# EAGLE board aqc-rev3 (EAGLE 9.2.2), part 1 of 2
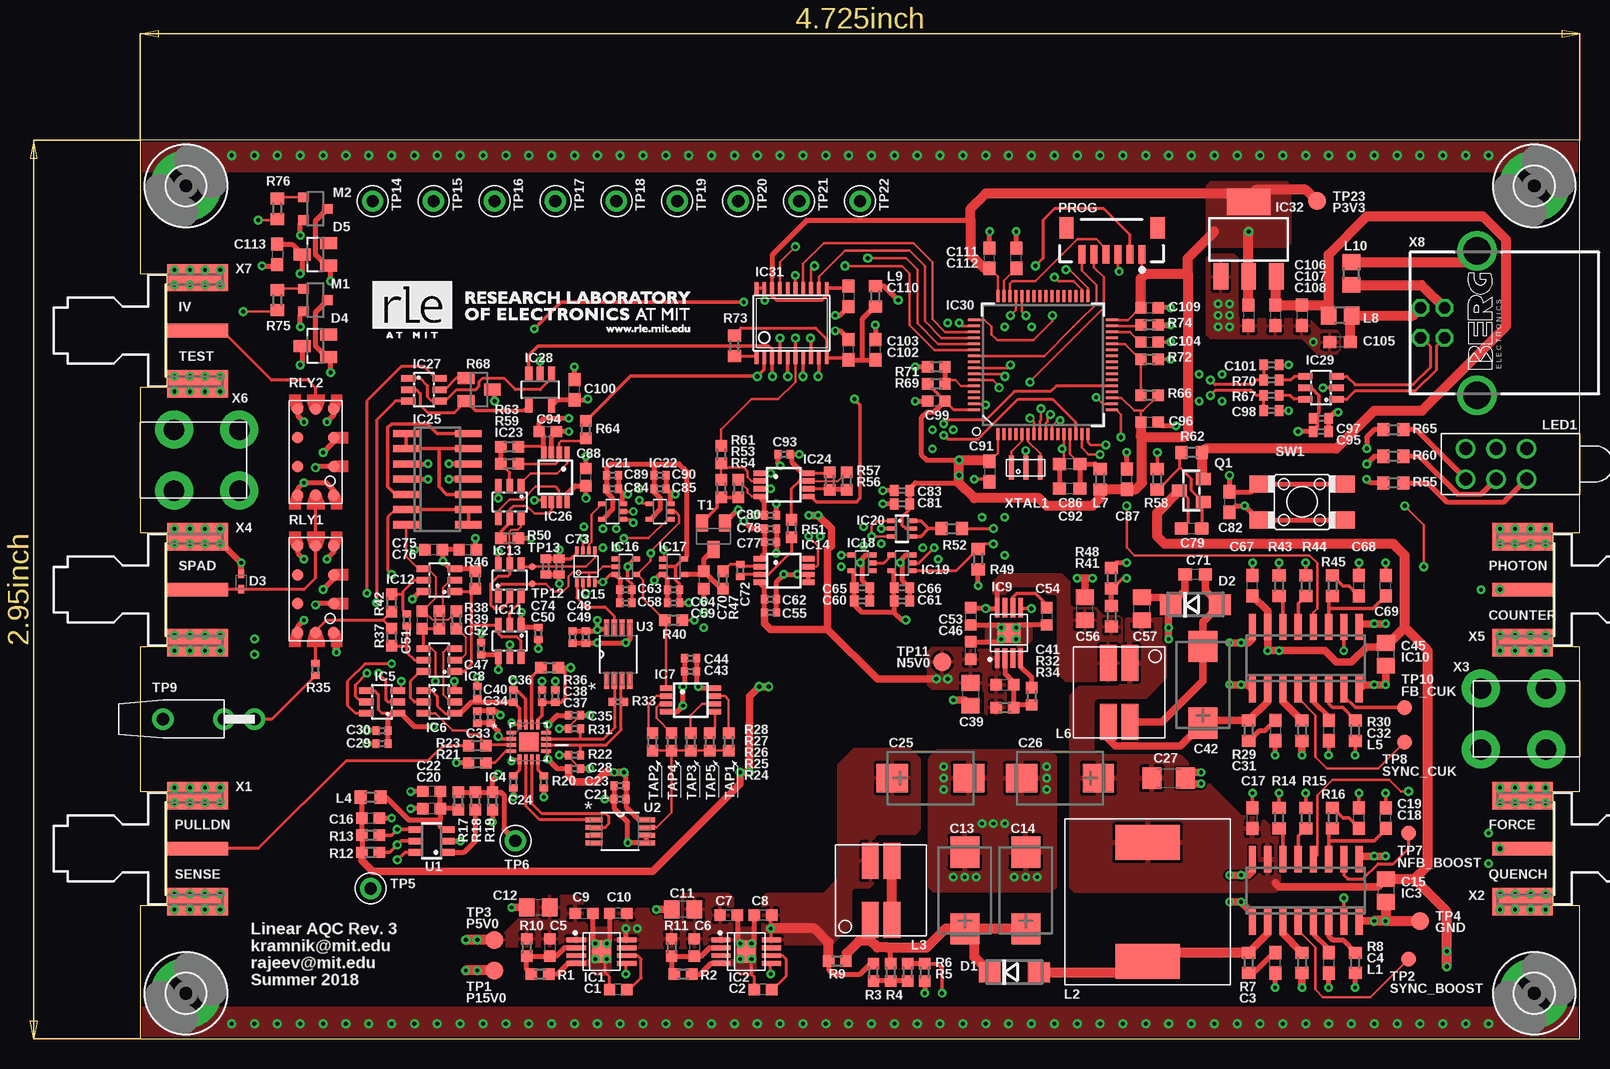
[diagram p12: board, top side]
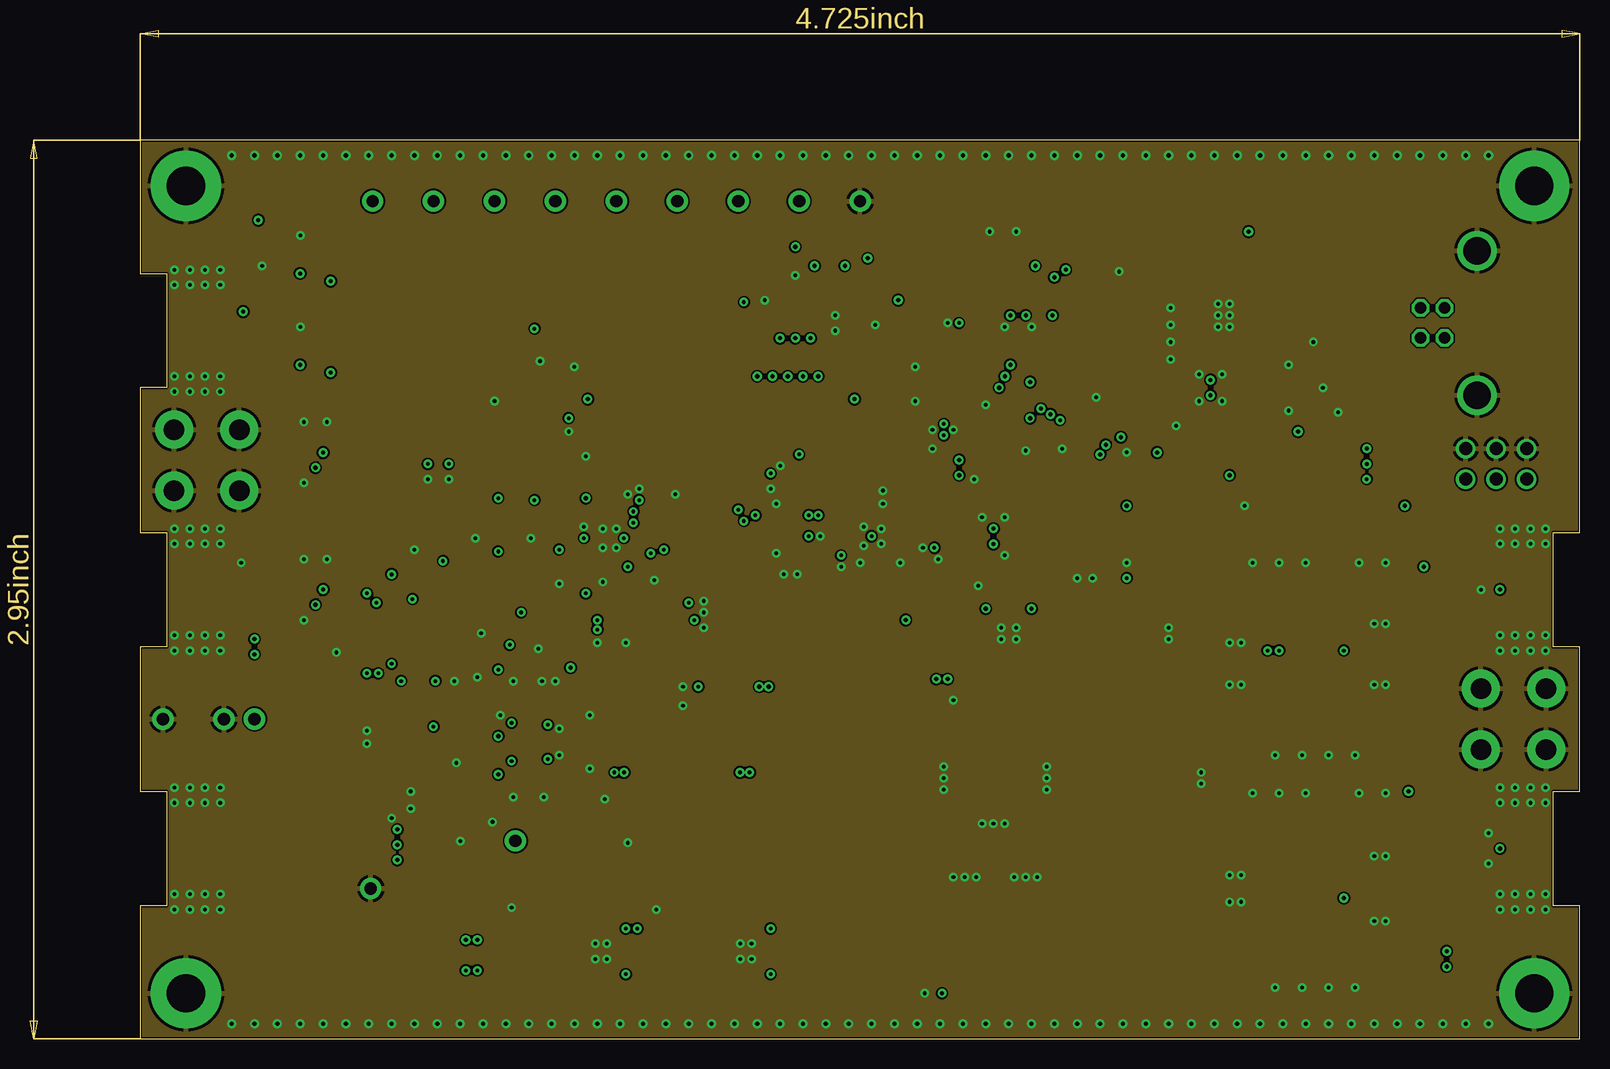
[diagram p13: board, inner layer Route2]
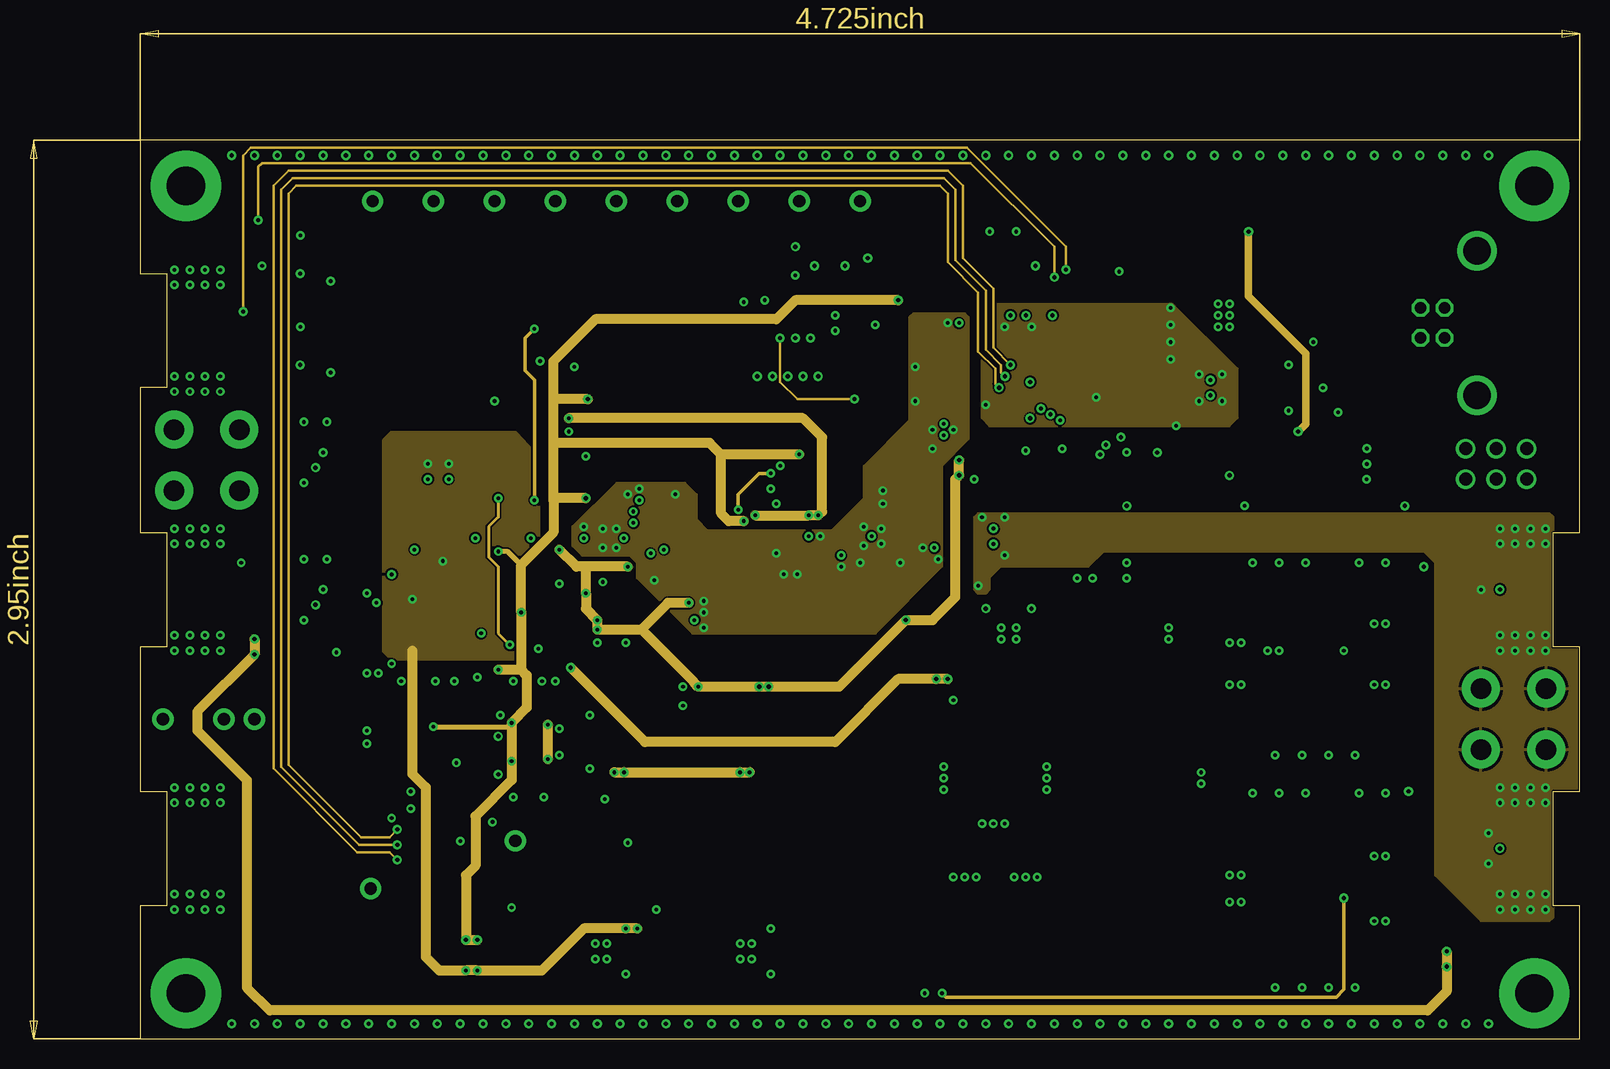
[diagram p14: board, inner layer Route15]
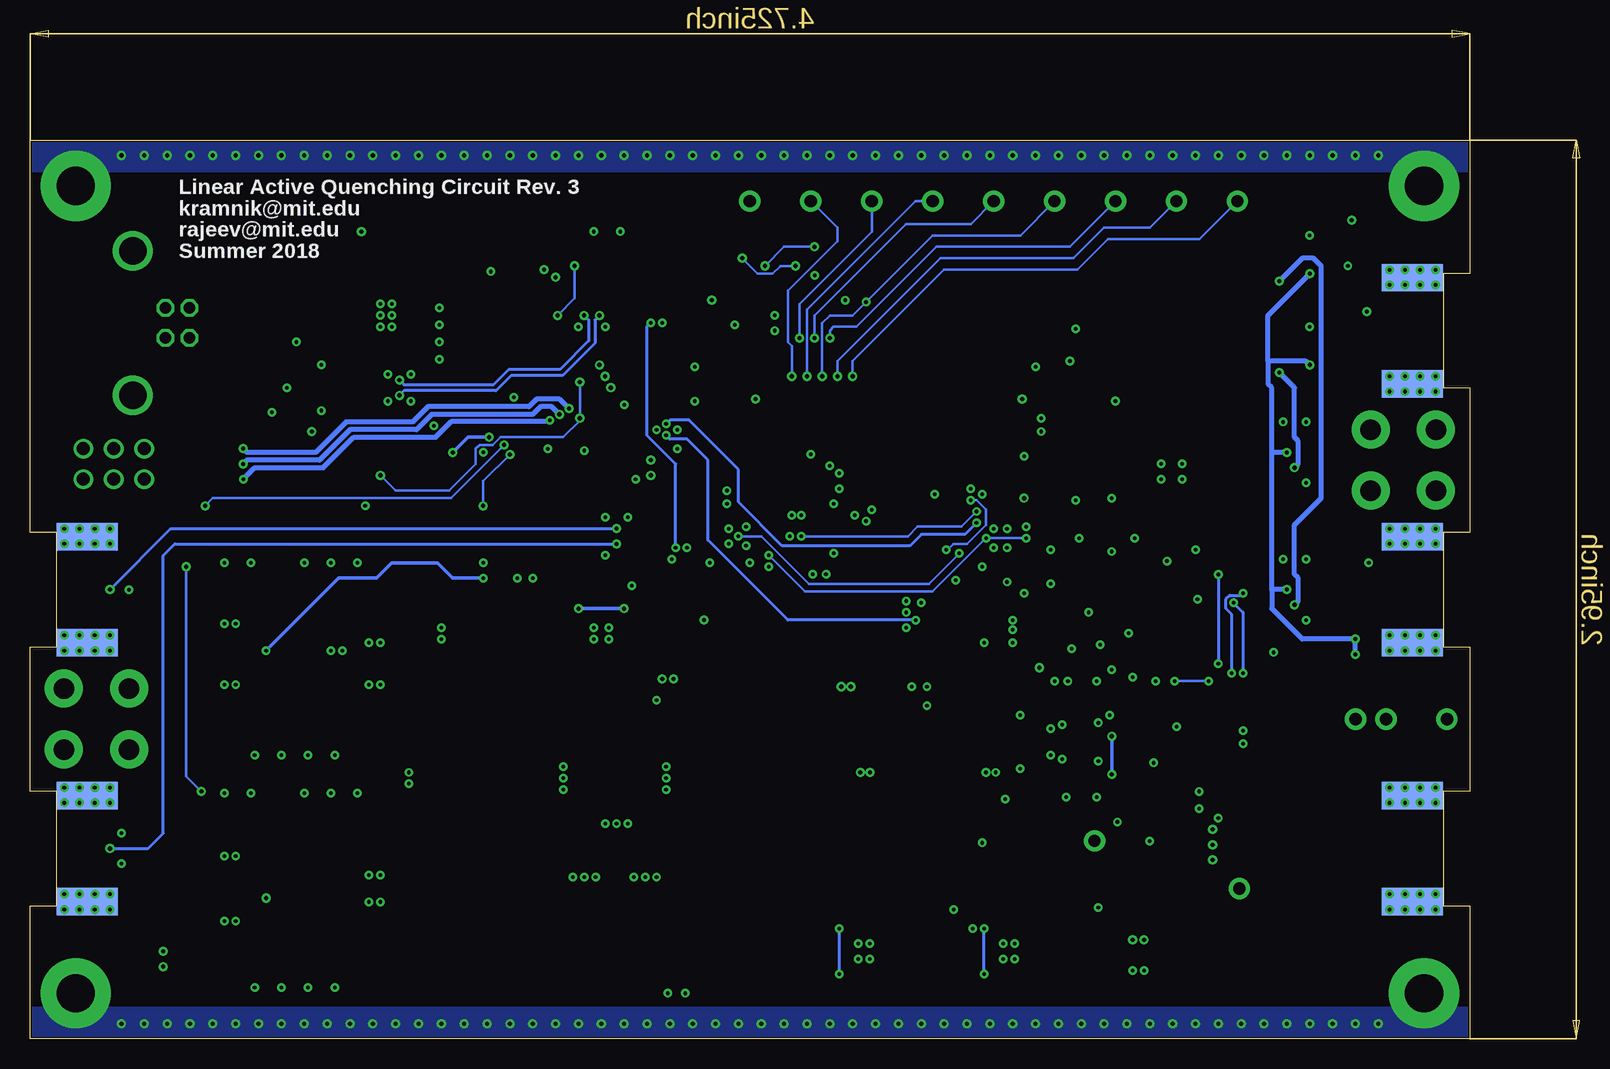
[diagram p15: board, bottom side, seen from below]

Size 120.02 x 74.93 mm. Coordinates in mm from the lower left corner, seen from the top.
Outline: 120.02,74.93 0,74.93 0,63.82 2.22,63.82 2.22,54.29 0,54.29 0,42.23 2.22,42.23 2.22,32.7 0,32.7 0,20.64 2.22,20.64 2.22,11.11 0,11.11 0,0 120.02,0 120.02,11.11 117.79,11.11 117.79,20.64 120.02,20.64 120.02,32.7 117.79,32.7 117.79,42.23 120.02,42.23 120.02,74.93
Copper layers (1+2*15+16): Top 0.035mm / dielectric 1.5mm / Route2 0.035mm / dielectric 0.15mm / Route15 0.035mm / dielectric 0.2mm / Bottom 0.035mm
Design rules "default *": minimum track width 6mil, minimum drill 0.3mm, track to track 6mil, track to pad 6mil, pad to pad 6mil, via to via 6mil, smd to smd 0mil, copper to edge 6mil, drill to drill 6mil, minimum pad ring 10mil, minimum via ring 8mil, stop-mask expansion 2mil, vias tented up to drill 25mil, thermal gap 10mil
Net classes: 1 100OHM_DIFF: width 0.254 mm, clearance 0.254 mm

## Footprints (pad centres in the part's own frame; a part is rotated, then mirrored left to right if it is on the bottom)
C0603 = smd 0.95 x 0.95: 1 -0.725,0; 2 0.725,0
C0603' = smd 1.1 x 1: 1 -0.85,0; 2 0.85,0
C0805 = smd 1.3 x 1.5: 1 -0.95,0; 2 0.95,0
CT7343 = smd 2.6 x 2.4: + -3.2,0; - 3.2,0
C0402 = smd 0.6 x 0.7: 1 -0.5,0; 2 0.5,0
C1206 = smd 1.6 x 1.8: 1 -1.4,0; 2 1.4,0
C0402' = smd 0.7 x 0.9: 1 -0.65,0; 2 0.65,0
DO214AC = smd 1.8 x 1.7: A 2.05,0; C -2.05,0
SOD523 = smd 0.7 x 0.5: A 0.7,0; C -0.6,0
SOT23 = smd 1 x 1.4: 1 -0.95,-1.1; 2 0.95,-1.1; 3 0,1.1
3,2-PAD = drill 3.2 pad 5.842: B3,2 0,0
MSOP-8_POWER_PAD = smd 0.4 x 1.6: 1 0,0; 2 0.65,0; 3 1.3,0; 4 1.95,0; 5 1.95,4.2; 6 1.3,4.2; 7 0.65,4.2; 8 0,4.2 | smd 1.89 x 1.57: PAD 0.975,2.1
SO16 = smd 0.6 x 2.2: 1 -4.445,-2.6; 2 -3.175,-2.6; 3 -1.905,-2.6; 4 -0.635,-2.6; 5 0.635,-2.6; 6 1.905,-2.6; 7 3.175,-2.6; 8 4.445,-2.6; 9 4.445,2.6; 10 3.175,2.6; 11 1.905,2.6; 12 0.635,2.6; 13 -0.635,2.6; 14 -1.905,2.6; 15 -3.175,2.6; 16 -4.445,2.6
QFN50P300X300X80-16N = smd 0.813 x 0.305: 1 -1.448,0.762; 2 -1.448,0.254; 3 -1.448,-0.254; 4 -1.448,-0.762; 9 1.448,-0.762; 10 1.448,-0.254; 11 1.448,0.254; 12 1.448,0.762 | smd 0.305 x 0.813: 5 -0.762,-1.448; 6 -0.254,-1.448; 7 0.254,-1.448; 8 0.762,-1.448; 13 0.762,1.448; 14 0.254,1.448; 15 -0.254,1.448; 16 -0.762,1.448 | smd 1.6 x 1.6: 17 0,0
SOT23-6L = smd 0.55 x 1.2: 1 -0.95,-1.3; 2 0,-1.3; 3 0.95,-1.3; 4 0.95,1.3; 5 0,1.3; 6 -0.95,1.3
MSOP8 = smd 0.45 x 1: 1 -0.975,-2.05; 2 -0.325,-2.05; 3 0.325,-2.05; 4 0.975,-2.05; 5 0.975,2.05; 6 0.325,2.05; 7 -0.325,2.05; 8 -0.975,2.05
US8_3.1MM_JDEC_MO-187 = smd 0.3 x 0.7: 1 -0.75,-1.35; 2 -0.25,-1.35; 3 0.25,-1.35; 4 0.75,-1.35; 5 0.75,1.35; 6 0.25,1.35; 7 -0.25,1.35; 8 -0.75,1.35
SC70-5 = smd 0.4 x 0.7: 1 -0.65,-0.85; 2 0,-0.85; 3 0.65,-0.85; 4 0.65,0.85; 5 -0.65,0.85
SC70-6L = smd 0.35 x 0.8: 1 -0.65,-0.85; 2 0,-0.85; 3 0.65,-0.85; 4 0.65,0.85; 5 0,0.85; 6 -0.65,0.85
SO14 = smd 0.6 x 2.2: 1 -3.81,-2.6; 2 -2.54,-2.6; 3 -1.27,-2.6; 4 0,-2.6; 5 1.27,-2.6; 6 2.54,-2.6; 7 3.81,-2.6; 8 3.81,2.6; 9 2.54,2.6; 10 1.27,2.6; 11 0,2.6; 12 -1.27,2.6; 13 -2.54,2.6; 14 -3.81,2.6
SOT23-5 = smd 0.6 x 1.2: 1 -0.95,-1.306; 2 0,-1.306; 3 0.95,-1.306; 4 0.95,1.306; 5 -0.95,1.306
TQFP64_STM32 = smd 0.22 x 1: 1 -3.75,-5.75; 2 -3.25,-5.75; 3 -2.75,-5.75; 4 -2.25,-5.75; 5 -1.75,-5.75; 6 -1.25,-5.75; 7 -0.75,-5.75; 8 -0.25,-5.75; 9 0.25,-5.75; 10 0.75,-5.75; 11 1.25,-5.75; 12 1.75,-5.75; 13 2.25,-5.75; 14 2.75,-5.75; 15 3.25,-5.75; 16 3.75,-5.75; 33 3.75,5.75; 34 3.25,5.75; 35 2.75,5.75; 36 2.25,5.75; 37 1.75,5.75; 38 1.25,5.75; 39 0.75,5.75; 40 0.25,5.75; 41 -0.25,5.75; 42 -0.75,5.75; 43 -1.25,5.75; 44 -1.75,5.75; 45 -2.25,5.75; 46 -2.75,5.75; 47 -3.25,5.75; 48 -3.75,5.75 | smd 1 x 0.22: 17 5.75,-3.75; 18 5.75,-3.25; 19 5.75,-2.75; 20 5.75,-2.25; 21 5.75,-1.75; 22 5.75,-1.25; 23 5.75,-0.75; 24 5.75,-0.25; 25 5.75,0.25; 26 5.75,0.75; 27 5.75,1.25; 28 5.75,1.75; 29 5.75,2.25; 30 5.75,2.75; 31 5.75,3.25; 32 5.75,3.75; 49 -5.75,3.75; 50 -5.75,3.25; 51 -5.75,2.75; 52 -5.75,2.25; 53 -5.75,1.75; 54 -5.75,1.25; 55 -5.75,0.75; 56 -5.75,0.25; 57 -5.75,-0.25; 58 -5.75,-0.75; 59 -5.75,-1.25; 60 -5.75,-1.75; 61 -5.75,-2.25; 62 -5.75,-2.75; 63 -5.75,-3.25; 64 -5.75,-3.75
TSSOP20 = smd 0.305 x 0.991: 1 -2.925,-2.918; 2 -2.275,-2.918; 3 -1.625,-2.918; 4 -0.975,-2.918; 5 -0.325,-2.918; 6 0.325,-2.918; 7 0.975,-2.918; 8 1.625,-2.918; 9 2.275,-2.918; 10 2.925,-2.918; 11 2.925,2.918; 12 2.275,2.918; 13 1.625,2.918; 14 0.975,2.918; 15 0.325,2.918; 16 -0.325,2.918; 17 -0.975,2.918; 18 -1.625,2.918; 19 -2.275,2.918; 20 -2.925,2.918
SOT-223 = smd 1.219 x 2.235: 1 -2.311,-3.099; 2 0,-3.099; 3 2.311,-3.099 | smd 3.6 x 2.2: 4 0,3.099
R0603 = smd 1 x 1.1: 1 -0.85,0; 2 0.85,0
WE_INDUCTOR_SIZE_CODE_1210 = smd 5.4 x 2.9: 1 0,4.95; 2 0,-4.95
SRF0703 = smd 1.4 x 3: 1 0.9,2.45; 2 -0.9,2.45; 3 -0.9,-2.45; 4 0.9,-2.45
R0805 = smd 1.3 x 1.5: 1 -0.95,0; 2 0.95,0
CBI-564-0X00-XXX = drill 1.092: BOT_A -1.27,-2.54; BOT_K 1.27,-2.54; MID_A -1.27,0; MID_K 1.27,0; TOP_A -1.27,2.54; TOP_K 1.27,2.54
SOT23R_INFINEON = smd 0.8 x 0.9: 1 -0.95,-1; 2 0.95,-1; 3 0,1
JST-6-SMD-VERT-1.0MM = smd 0.6 x 1.55: 1 -2.54,1.27; 2 -1.54,1.27; 3 -0.54,1.27; 4 0.46,1.27; 5 1.46,1.27; 6 2.46,1.27 | smd 1.2 x 1.8: P$1 -3.84,-0.955; P$2 3.76,-0.955
SOT23-WIDE = smd 1 x 1.27: 1 -0.95,-1; 2 0.95,-1; 3 0,1
R0603' = smd 0.95 x 0.95: 1 -0.725,0; 2 0.725,0
R0402 = smd 0.6 x 0.7: 1 -0.5,0; 2 0.5,0
R0402' = smd 0.7 x 0.9: 1 -0.65,0; 2 0.65,0
SOT23C = smd 1 x 1.4: 1 -0.95,-1.1; 2 0.95,-1.1; 3 0,1.1
MEDER_RELAY_CRF = smd 0.95 x 0.95: 1 1.2,0.7; 2 3.6,0.7; 3 6,0.7; 4 8.4,0.7; 5 8.4,2.2; 6 8.4,3.7; 7 6,3.7; 8 3.6,3.7; 9 1.2,3.7; 10 1.2,2.2
E-SWITCH-TL3305AF160QG = smd 1.6 x 1.4: 1 -3.6,-1.5; 2 3.6,-1.5; 3 -3.6,1.5; 4 3.6,1.5
SOT23-BEC = smd 1 x 1.4: B -0.95,-1.1; C 0,1.1; E 0.95,-1.1
TP15R = smd 1.5 x 1.5: TP 0,0
B1,27 = smd 1.27 x 1.27: TP 0,0
KEYSTONE_5000_MINIATURE = drill 1.016 pad 1.778: P$1 0,0
JOHNSON-129-0701-30X = drill 1.041 pad 1.778: GND1 2.54,0; GND2 7.62,0; SIG 0,0
TP06R = smd 0.6 x 0.6: TP 0,0
SOT23-6 = smd 0.55 x 1.2: 1 -0.95,-1.3; 2 0,-1.3; 3 0.95,-1.3; 4 0.95,1.3; 5 0,1.3; 6 -0.95,1.3
SOP65P490X110-8N = smd 1.422 x 0.432: 1 -2.184,0.965; 2 -2.184,0.33; 3 -2.184,-0.33; 4 -2.184,-0.965; 5 2.184,-0.965; 6 2.184,-0.33; 7 2.184,0.33; 8 2.184,0.965
J502-ND-142-0701-881/886 = smd 5.08 x 1.143: 1 2.565,0 | smd 5.08 x 2.286: G@1 2.565,4.42; G@2 2.565,-4.42 | smd 5.08 x 2.286 bottom: G@3 2.565,4.42; G@4 2.565,-4.42
KEYSTONE-7774 = drill 1.702 pad 3.175: 1 2.819,-2.54; 2 8.255,-2.54; 3 8.255,2.54; 4 2.819,2.54
PN61729-S = drill 0.95 octagon: 1 1.25,4.71; 2 -1.25,4.71; 3 -1.25,2.71; 4 1.25,2.71 | drill 2.3 pad 2.9: S1 -6.02,0; S2 6.02,0
CSTCE_G15L/CSTCE_GH5L = smd 0.4 x 2: 1 -1.2,0; 2 0,0; 3 1.2,0

## Placement (x,y rotation side)
C1  CAP CER 10000PF 25V X7R 0603 10%  [C0603]  39.85,4.13 180 top
C2  CAP CER 10000PF 25V X7R 0603 10%  [C0603]  51.91,4.13 180 top
C3  CAP CER 1000PF 50V X7R 0603 10%  [C0603']  94.61,6.35 90 top
C4  CAP CER 1300PF 50V C0G 0603 5%  [C0603']  99.06,6.35 270 top
C5  CAP CER 10000PF 25V X7R 0603 10%  [C0603]  34.13,7.62 270 top
C6  CAP CER 10000PF 25V X7R 0603 10%  [C0603]  46.2,7.62 270 top
C7  CAP CER 0.1UF 25V X7R 0603 10%  [C0603]  49.05,10.32 0 top
C8  CAP CER 0.1UF 25V X7R 0603 10%  [C0603]  51.91,10.32 180 top
C9  CAP CER 0.1UF 25V X7R 0603 10%  [C0603]  36.99,10.48 0 top
C10  CAP CER 0.1UF 25V X7R 0603 10%  [C0603]  39.85,10.48 180 top
C11  CAP CER 10UF 25V X5R 0805 10%  [C0805]  45.24,10.79 180 top
C12  CAP CER 10UF 16V X7R 0805 20%  [C0805]  33.18,10.95 180 top
C13  CAP ALUM POLY 47UF 20% 20V SMD  [CT7343]  68.74,12.38 90 top
C14  CAP ALUM POLY 47UF 20% 20V SMD  [CT7343]  73.82,12.38 90 top
C15  CAP CER 4.7UF 25V X7R 0805 10%  [C0805]  103.82,12.38 270 top
C16  CAP CER 0.1UF 25V X7R 0603 10%  [C0603]  19.21,18.41 0 top
C17  CAP CER 0.1UF 25V X7R 0603 10%  [C0603']  92.71,18.41 90 top
C18  CAP CER 0.015UF 50V X7R 0603 10%  [C0603']  101.6,18.41 90 top
C19  CAP CER 220PF 50V C0G 0603 5%  [C0603']  103.82,18.41 90 top
C20  CAP CER 0.1UF 25V X7R 0603 10%  [C0603]  24.29,19.21 180 top
C21  CAP CER 10000PF 10V X7R 0402 10%  [C0402]  40.01,20 180 top
C22  CAP CER 4.7UF 6.3V X7R 0603 10%  [C0603]  24.29,20.64 180 top
C23  CAP CER 0.1UF 10V X7R 0402 10%  [C0402]  40.01,21.11 180 top
C24  CAP CER 10000PF 10V X7R 0402 10%  [C0402]  31.11,21.43 270 top
C25  CAP ALUM POLY 47UF 20% 20V SMD  [CT7343]  65.88,21.75 0 top
C26  CAP ALUM POLY 47UF 20% 20V SMD  [CT7343]  76.68,21.75 180 top
C27  CAP CER 10UF 10V X7R 1206 10%  [C1206]  85.72,21.75 0 top
C28  CAP CER 10000PF 10V X7R 0402 10%  [C0402]  36.2,22.54 0 top
C29  CAP CER 0.1UF 10V X7R 0402 10%  [C0402]  20.16,24.61 180 top
C30  CAP CER 10000PF 10V X7R 0402 10%  [C0402]  20.16,25.72 180 top
C31  CAP CER 10000PF 25V X7R 0603 10%  [C0603']  94.61,25.72 270 top
C32  CAP CER 1300PF 50V C0G 0603 5%  [C0603']  99.06,25.72 270 top
C33  CAP CER 0.1UF 10V X7R 0402 10%  [C0402]  28.1,26.83 90 top
C34  CAP CER 10000PF 10V X7R 0402 10%  [C0402]  29.21,26.83 90 top
C35  CAP CER 0.1UF 10V X7R 0402 10%  [C0402]  36.2,26.99 0 top
C36  CAP CER 0.1UF 10V X7R 0402 10%  [C0402]  31.11,28.57 90 top
C37  CAP CER 0.1UF 10V X7R 0402 10%  [C0402]  33.5,28.57 90 top
C38  CAP CER 10000PF 10V X7R 0402 10%  [C0402]  34.61,28.57 90 top
C39  CAP CER 10UF 16V X7R 0805 20%  [C0805]  69.22,28.73 270 top
C40  CAP CER 10000PF 10V X7R 0402 10%  [C0402]  28.1,28.89 90 top
C41  CAP CER 10000PF 25V X7R 0603 10%  [C0603]  72.07,29.53 0 top
C42  CAP ALUM POLY 68UF 20% 16V SMD  [CT7343]  88.58,29.53 90 top
C43  CAP CER 0.1UF 10V X7R 0402 10%  [C0402]  45.88,30.64 180 top
C44  CAP CER 10000PF 10V X7R 0402 10%  [C0402]  45.88,31.75 180 top
C45  CAP CER 4.7UF 25V X7R 0805 10%  [C0805]  103.82,32.07 270 top
C46  CAP CER 0.1UF 25V X7R 0603 10%  [C0603]  69.22,32.38 90 top
C47  CAP CER 10000PF 10V X7R 0402 10%  [C0402]  28.42,32.54 90 top
C48  CAP CER 10000PF 10V X7R 0402 10%  [C0402]  36.04,33.5 270 top
C49  CAP CER 0.1UF 10V X7R 0402 10%  [C0402]  37.15,33.5 270 top
C50  CAP CER 10000PF 10V X7R 0402 10%  [C0402]  33.18,33.81 270 top
C51  CAP CER 100PF 25V C0G/NP0 0402  [C0402]  22.23,34.92 270 top
C52  CAP CER 10000PF 25V X7R 0603 10%  [C0603]  23.5,34.92 270 top
C53  CAP CER 0.1UF 25V X7R 0603 10%  [C0603]  69.22,35.24 270 top
C54  CAP CER 10000PF 25V X7R 0603 10%  [C0603]  75.56,35.24 270 top
C55  CAP CER 0.1UF 10V X7R 0402 10%  [C0402]  52.55,35.56 0 top
C56  CAP CER 10UF 16V X7R 0805 20%  [C0805]  78.74,35.88 90 top
C57  CAP CER 4.7UF 25V X7R 0805 10%  [C0805]  83.5,35.88 90 top
C58  CAP CER 0.1UF 10V X7R 0402 10%  [C0402]  40.48,36.35 180 top
C59  CAP CER 0.1UF 10V X7R 0402 10%  [C0402]  44.45,36.35 180 top
C60  CAP CER 10000PF 10V X7R 0402 10%  [C0402']  60.17,36.51 0 top
C61  CAP CER 0.1UF 10V X7R 0402 10%  [C0402']  63.5,36.51 0 top
C62  CAP CER 10000PF 10V X7R 0402 10%  [C0402]  52.55,36.67 0 top
C63  CAP CER 10000PF 10V X7R 0402 10%  [C0402]  40.48,37.47 180 top
C64  CAP CER 10000PF 10V X7R 0402 10%  [C0402]  44.45,37.47 180 top
C65  CAP CER 0.1UF 10V X7R 0402 10%  [C0402']  60.17,37.62 0 top
C66  CAP CER 10000PF 10V X7R 0402 10%  [C0402']  63.5,37.62 0 top
C67  CAP CER 0.1UF 25V X7R 0603 10%  [C0603']  92.71,37.78 90 top
C68  CAP CER 0.033UF 50V X7R 0603 10%  [C0603']  101.6,37.78 90 top
C69  DNP  [C0603']  103.82,37.78 90 top
C70  CAP CER 100PF 50V C0G 0603 5%  [C0603]  46.99,38.26 270 top
C71  DNP  [C0603']  87.95,38.73 180 top
C72  DNP  [C0402]  50.01,39.05 270 top
C73  CAP CER 0.1UF 10V X7R 0402 10%  [C0402']  33.81,39.37 270 top
C74  CAP CER 10000PF 10V X7R 0402 10%  [C0402']  34.92,39.37 270 top
C75  CAP CER 10000PF 25V X7R 0603 10%  [C0603]  24.45,40.8 180 top
C76  CAP CER 0.1UF 25V X7R 0603 10%  [C0603]  27.3,40.8 0 top
C77  CAP CER 0.1UF 10V X7R 0402 10%  [C0402]  52.55,41.43 0 top
C78  CAP CER 10000PF 10V X7R 0402 10%  [C0402]  52.55,42.55 0 top
C79  CAP CER 0.1UF 25V X7R 0603 10%  [C0603']  87.63,42.55 180 top
C80  CAP CER 0.1UF 10V X7R 0402 10%  [C0402]  52.55,43.66 0 top
C81  CAP CER 10000PF 10V X7R 0402 10%  [C0402']  63.5,44.61 180 top
C82  CAP CER 10000PF 25V X7R 0603 10%  [C0603']  90.81,44.77 270 top
C83  CAP CER 0.1UF 10V X7R 0402 10%  [C0402']  63.5,45.72 180 top
C84  CAP CER 10000PF 10V X7R 0402 10%  [C0402]  39.37,45.88 0 top
C85  CAP CER 10000PF 10V X7R 0402 10%  [C0402]  43.34,45.88 0 top
C86  CAP CER 4.7UF 6.3V X7R 0603 10%  [C0603']  77.47,45.88 180 top
C87  CAP CER 4.7UF 6.3V X7R 0603 10%  [C0603']  82.23,46.67 90 top
C88  CAP CER 0.1UF 25V X7R 0603 10%  [C0603]  37.15,46.83 90 top
C89  CAP CER 0.1UF 10V X7R 0402 10%  [C0402]  39.37,46.99 0 top
C90  CAP CER 0.1UF 10V X7R 0402 10%  [C0402]  43.34,46.99 0 top
C91  CAP CER 0.1UF 25V X7R 0603 10%  [C0603']  70.8,47.31 270 top
C92  CAP CER 0.1UF 25V X7R 0603 10%  [C0603']  77.47,47.94 180 top
C93  CAP CER 0.1UF 10V X7R 0402 10%  [C0402]  53.66,48.74 180 top
C94  CAP CER 0.1UF 25V X7R 0603 10%  [C0603]  33.97,50.64 0 top
C95  CAP CER 0.1UF 10V X7R 0402 10%  [C0402']  98.42,50.64 0 top
C96  CAP CER 0.1UF 25V X7R 0603 10%  [C0603]  84.14,51.44 0 top
C97  CAP CER 10000PF 10V X7R 0402 10%  [C0402']  98.42,51.75 0 top
C98  CAP CER 47PF 16V C0G 0402 5%  [C0402']  94.3,52.39 0 top
C99  CAP CER 0.1UF 25V X7R 0603 10%  [C0603]  66.36,53.18 180 top
C100  CAP CER 0.1UF 25V X7R 0603 10%  [C0603']  36.2,54.13 90 top
C101  CAP CER 47PF 16V C0G 0402 5%  [C0402']  94.3,56.2 0 top
C102  CAP CER 0.1UF 25V X7R 0603 10%  [C0603']  59.05,57.47 90 top
C103  CAP CER 4.7UF 6.3V X7R 0603 10%  [C0603']  61.28,57.47 90 top
C104  CAP CER 0.1UF 25V X7R 0603 10%  [C0603]  84.14,58.1 0 top
C105  CAP CER 10000PF 25V X7R 0603 10%  [C0603']  100.01,58.1 180 top
C106  CAP CER 0.1UF 25V X7R 0603 10%  [C0603']  92.39,60.33 270 top
C107  CAP CER 0.1UF 25V X7R 0603 10%  [C0603']  94.61,60.33 270 top
C108  CAP CER 4.7UF 6.3V X7R 0603 10%  [C0603']  96.84,60.33 270 top
C109  CAP CER 0.1UF 25V X7R 0603 10%  [C0603]  84.14,60.96 0 top
C110  CAP CER 0.1UF 25V X7R 0603 10%  [C0603']  59.05,61.91 270 top
C111  CAP CER 0.1UF 25V X7R 0603 10%  [C0603']  70.8,65.09 90 top
C112  CAP CER 0.1UF 25V X7R 0603 10%  [C0603']  73.03,65.09 90 top
C113  CAP CER 0.1UF 25V X7R 0603 10%  [C0603']  11.43,65.41 270 top
D1  CDBA140SL-HF  [DO214AC]  72.87,5.56 0 top
D2  CDBA140SL-HF  [DO214AC]  87.95,36.2 0 top
D3  DF2B29FU,H3F  [SOD523]  8.41,38.1 90 top
D4  BAS40  [SOT23]  14.61,57.78 90 top
D5  BAS40  [SOT23]  14.61,65.41 90 top
DNP1000  RLE_LOGO  [RLE_LOGO]  19.05,58.1 0 top
H1  MOUNT-PAD-ROUND3.2  [3,2-PAD]  3.81,3.81 0 top
H2  MOUNT-PAD-ROUND3.2  [3,2-PAD]  116.2,3.81 0 top
H3  MOUNT-PAD-ROUND3.2  [3,2-PAD]  3.81,71.12 0 top
H4  MOUNT-PAD-ROUND3.2  [3,2-PAD]  116.2,71.12 0 top
IC1  TPS7A4901  [MSOP-8_POWER_PAD]  36.35,8.26 270 top
IC2  TPS7A4901  [MSOP-8_POWER_PAD]  48.42,8.26 270 top
IC3  LT1534-1  [SO16]  97.16,12.38 0 top
IC4  ADCMP582  [QFN50P300X300X80-16N]  32.38,24.77 0 top
IC5  HFA3134  [SOT23-6L]  20.16,28.1 90 top
IC6  HFA3135  [SOT23-6L]  24.92,28.1 270 top
IC7  DS1100LU-45+  [MSOP8]  45.88,28.26 270 top
IC8  HFA3135  [SOT23-6L]  24.92,31.59 90 top
IC9  TPS7A3001  [MSOP-8_POWER_PAD]  71.44,31.75 0 top
IC10  LT1534-1  [SO16]  97.16,31.75 0 top
IC11  HFA3134  [SOT23-6L]  30.8,33.18 180 top
IC12  HFA3134  [SOT23-6L]  24.92,38.26 90 top
IC13  HFA3134  [SOT23-6L]  30.8,38.26 0 top
IC14  LTC1711  [MSOP8]  53.66,39.05 270 top
IC15  NC7SV74K8X  [US8_3.1MM_JDEC_MO-187]  37.15,39.37 0 top
IC16  74AHC1G14DCK  [SC70-5]  40.48,39.37 270 top
IC17  NL17SZ125  [SC70-5]  44.45,39.37 270 top
IC18  74AHC1G04DCK  [SC70-5]  60.17,39.69 90 top
IC19  74AHC1G32DCK  [SC70-5]  63.5,39.69 90 top
IC20  NC7WZ16P6X  [SC70-6L]  63.5,42.55 270 top
IC21  74AHC1G08DCK  [SC70-5]  39.37,43.97 90 top
IC22  74AHC1G08DCK  [SC70-5]  43.34,43.97 90 top
IC23  HFA3134  [SOT23-6L]  30.8,44.77 180 top
IC24  TLV272DGK  [MSOP8]  53.66,46.2 270 top
IC25  THAT320  [SO14]  24.77,46.67 270 top
IC26  TLV272DGK  [MSOP8]  34.61,46.83 180 top
IC27  HFA3134  [SOT23-6L]  23.65,54.13 270 top
IC28  TLV271DBV  [SOT23-5]  33.34,54.13 180 top
IC29  USBLC6-2SC6Y  [SOT23-6L]  98.42,54.29 90 top
IC30  STM32F411RE  [TQFP64_STM32]  75.25,56.2 0 top
IC31  MAX5725  [TSSOP20]  54.29,59.69 0 top
IC32  LM1117  [SOT-223]  92.39,66.67 0 top
L1  25n  [R0603]  96.84,6.35 270 top
L2  Wurth-7447709471  [WE_INDUCTOR_SIZE_CODE_1210]  83.98,11.43 0 top
L3  SRF0703-820M  [SRF0703]  61.75,12.38 180 top
L4  PE-0603FB601ST  [R0603]  19.21,20.16 0 top
L5  25n  [R0603]  96.84,25.72 270 top
L6  SRF0703-820M  [SRF0703]  81.6,28.89 0 top
L7  PE-0603FB601ST  [R0603]  80.01,46.67 90 top
L8  MI0805J102R-10  [R0805]  100.01,60.33 180 top
L9  PE-0603FB601ST  [R0603]  61.28,61.91 270 top
L10  MI0805J102R-10  [R0805]  100.97,63.82 90 top
LED1  Dialight-5640200132F  [CBI-564-0X00-XXX]  113.03,47.94 90 top
M1  BSS806N  [SOT23R_INFINEON]  14.61,61.59 270 top
M2  BSS806N  [SOT23R_INFINEON]  14.61,69.22 270 top
PROG  JST_VERT  [JST-6-SMD-VERT-1.0MM]  80.96,66.67 180 top
Q1  DMG2305UX-13  [SOT23-WIDE]  87.63,45.72 90 top
R1  RES SMD 24K OHM 1% 1/10W 0603  [R0603']  33.34,5.4 0 top
R2  RES SMD 11.8K OHM 1% 1/10W 0603  [R0603']  45.24,5.4 0 top
R3  RES SMD 0 OHM JUMPER 0603  [R0603']  61.12,5.56 270 top
R4  DNP  [R0603']  62.55,5.56 270 top
R5  RES SMD 29.4K OHM 1% 1/10W 0603  [R0603']  63.98,5.56 270 top
R6  RES SMD 2.49K OHM 1% 1/10W 0603  [R0603']  65.41,5.56 270 top
R7  RES SMD 10 OHM 1% 1/10W 0603  [R0603]  92.39,6.35 270 top
R8  RES SMD 16.9K OHM 1% 1/10W 0603  [R0603]  101.28,6.35 90 top
R9  DNP  [R0603']  58.1,6.51 180 top
R10  RES SMD 76.8K OHM 1% 1/10W 0603  [R0603']  32.23,7.62 90 top
R11  RES SMD 137K OHM 1% 1/10W 0603  [R0603']  44.29,7.62 90 top
R12  RES SMD 2.2K OHM 1% 1/10W 0603  [R0603']  19.21,15.56 0 top
R13  RES SMD 2.2K OHM 1% 1/10W 0603  [R0603']  19.21,16.99 0 top
R14  RES SMD 1K OHM 1% 1/10W 0603  [R0603]  94.93,18.41 90 top
R15  RES SMD 1K OHM 1% 1/10W 0603  [R0603]  97.16,18.41 90 top
R16  RES SMD 6.8K OHM 1% 1/10W 0603  [R0603]  99.38,18.41 270 top
R17  DNP  [R0603']  26.51,19.84 270 top
R18  RES SMD 1K OHM 1% 1/10W 0603  [R0603']  27.94,19.84 270 top
R19  DNP  [R0603']  29.37,19.84 90 top
R20  RES SMD 49.9 OHM 1% 1/10W 0402  [R0402]  33.66,21.43 270 top
R21  DNP  [R0603']  28.1,23.02 0 top
R22  RES SMD 150 OHM 1% 1/10W 0402  [R0402]  36.2,23.65 180 top
R23  RES SMD 220 OHM 1% 1/10W 0603  [R0603']  28.1,24.45 0 top
R24  DNP  [R0603']  42.7,24.77 90 top
R25  DNP  [R0603']  44.29,24.77 90 top
R26  DNP  [R0603']  45.88,24.77 90 top
R27  DNP  [R0603']  47.47,24.77 90 top
R28  DNP  [R0603']  49.05,24.77 90 top
R29  RES SMD 100 OHM 1% 1/8W 0603  [R0603]  92.39,25.72 270 top
R30  RES SMD 16.9K OHM 1% 1/10W 0603  [R0603]  101.28,25.72 90 top
R31  RES SMD 150 OHM 1% 1/10W 0402  [R0402]  36.2,25.88 180 top
R32  RES SMD 76.8K OHM 1% 1/10W 0603  [R0603']  72.07,27.62 180 top
R33  RES SMD 100 OHM 1% 1/10W 0402  [R0402]  39.85,28.1 180 top
R34  RES SMD 24K OHM 1% 1/10W 0603  [R0603']  74.3,28.57 90 top
R35  RES SMD 49.9 OHM 1% 1/10W 0402  [R0402]  14.61,30.8 270 top
R36  RES SMD 10K OHM 1% 1/10W 0603  [R0603']  34.13,30.96 180 top
R37  RES SMD 100 OHM 1% 1/8W 0603  [R0603']  20.95,33.5 90 top
R38  RES SMD 200 OHM 1% 1/10W 0603  [R0603']  24.92,34.92 90 top
R39  RES SMD 200 OHM 1% 1/10W 0603  [R0603']  26.35,34.92 90 top
R40  RES SMD 49.9 OHM 1% 1/10W 0603  [R0603']  44.45,34.92 180 top
R41  RES SMD 1.4K OHM 1% 1/10W 0603  [R0603]  80.96,35.24 90 top
R42  RES SMD 100 OHM 1% 1/8W 0603  [R0603']  20.95,36.35 90 top
R43  RES SMD 1K OHM 1% 1/10W 0603  [R0603]  94.93,37.78 90 top
R44  RES SMD 1K OHM 1% 1/10W 0603  [R0603]  97.16,37.78 90 top
R45  RES SMD 2K OHM 1% 1/10W 0603  [R0603]  99.38,37.78 270 top
R46  RES SMD 220 OHM 1% 1/10W 0603  [R0603']  27.94,38.26 90 top
R47  RES SMD 0 OHM JUMPER 0603  [R0603']  48.58,38.26 270 top
R48  RES SMD 1K OHM 1% 1/10W 0603  [R0603]  80.96,38.42 90 top
R49  RES SMD 49.9 OHM 1% 1/10W 0603  [R0603]  69.85,40.01 90 top
R50  RES SMD 110 OHM 1% 1/10W 0603  [R0603']  30.8,41.75 180 top
R51  RES SMD 0 OHM JUMPER 0603  [R0603']  54.29,42.55 90 top
R52  RES SMD 49.9 OHM 1% 1/10W 0603  [R0603]  67.63,42.55 180 top
R53  RES SMD 220K OHM 1% 1/10W 0603  [R0603']  48.42,45.88 90 top
R54  RES SMD 10K OHM 1% 1/10W 0603  [R0603']  49.85,45.88 90 top
R55  RES SMD 470 OHM 1% 1/10W 0603  [R0603]  104.46,46.35 180 top
R56  RES SMD 100K OHM 1% 1/10W 0603  [R0603']  57.47,46.51 90 top
R57  RES SMD 100K OHM 1% 1/10W 0603  [R0603']  58.9,46.51 270 top
R58  RES SMD 4.7K OHM 1% 1/10W 0603  [R0603]  84.77,46.67 90 top
R59  RES SMD 127K OHM 1% 1/10W 0603  [R0603']  30.8,47.94 0 top
R60  RES SMD 470 OHM 1% 1/10W 0603  [R0603]  104.46,48.58 180 top
R61  RES SMD 220K OHM 1% 1/10W 0603  [R0603']  48.42,48.74 90 top
R62  RES SMD 100K OHM 1% 1/10W 0603  [R0603]  87.63,48.9 0 top
R63  RES SMD 274 OHM 1% 1/10W 0603  [R0603']  30.8,49.37 180 top
R64  RES SMD 102K OHM 1% 1/10W 0603  [R0603']  37.15,50.8 90 top
R65  RES SMD 470 OHM 1% 1/10W 0603  [R0603]  104.46,50.8 180 top
R66  DNP  [R0603']  84.14,53.66 180 top
R67  RES SMD 22 OHM 1% 1/10W 0402  [R0402']  94.3,53.66 0 top
R68  SOT-DIV23LF-03-1001-1001-BB  [SOT23C]  28.26,54.13 270 top
R69  DNP  [R0603']  66.36,54.61 0 top
R70  RES SMD 22 OHM 1% 1/10W 0402  [R0402']  94.3,54.93 0 top
R71  RES SMD 0 OHM JUMPER 0603  [R0603']  66.36,56.04 180 top
R72  DNP  [R0603']  84.14,56.67 0 top
R73  RES SMD 0 OHM JUMPER 0603  [R0603]  49.53,57.78 270 top
R74  RES SMD 0 OHM JUMPER 0603  [R0603']  84.14,59.53 0 top
R75  RES SMD 100 OHM 1% 1/8W 0603  [R0603]  11.43,61.59 270 top
R76  RES SMD 100 OHM 1% 1/8W 0603  [R0603]  11.43,69.22 270 top
RLY1  CRF05-1A  [MEDER_RELAY_CRF]  16.83,32.7 90 top
RLY2  CRF05-1A  [MEDER_RELAY_CRF]  16.83,44.13 90 top
SW1  MCU_RST  [E-SWITCH-TL3305AF160QG]  96.84,44.77 0 top
T1  MMBTH10−4LT1G  [SOT23-BEC]  47.78,41.91 180 top
TP1  TPTP15R  [TP15R]  29.53,5.71 0 top
TP2  TPB1,27  [B1,27]  105.73,6.67 0 top
TP3  TPTP15R  [TP15R]  29.53,8.26 0 top
TP4  TPTP15R  [TP15R]  106.68,9.84 0 top
TP5  GND  [KEYSTONE_5000_MINIATURE]  19.21,12.54 270 top
TP6  VREF_AV_DET  [KEYSTONE_5000_MINIATURE]  31.27,16.51 0 top
TP7  TPB1,27  [B1,27]  105.73,17.14 0 top
TP8  TPB1,27  [B1,27]  105.41,24.77 0 top
TP9  TP_VSCOPE  [JOHNSON-129-0701-30X]  9.53,26.67 180 top
TP10  TPB1,27  [B1,27]  105.41,27.62 0 top
TP11  TPTP15R  [TP15R]  66.83,31.43 0 top
TP12  TPTP06R  [TP06R]  32.7,37.94 0 top
TP13  TPTP06R  [TP06R]  32.7,39.37 0 top
TP14  DELTA_V  [KEYSTONE_5000_MINIATURE]  19.37,69.85 0 top
TP15  DMND_IBIAS  [KEYSTONE_5000_MINIATURE]  24.45,69.85 0 top
TP16  OS_COMP  [KEYSTONE_5000_MINIATURE]  29.53,69.85 0 top
TP17  V_A  [KEYSTONE_5000_MINIATURE]  34.61,69.85 270 top
TP18  OS_CCS  [KEYSTONE_5000_MINIATURE]  39.69,69.85 270 top
TP19  EXTRA_1  [KEYSTONE_5000_MINIATURE]  44.77,69.85 270 top
TP20  EXTRA_2  [KEYSTONE_5000_MINIATURE]  49.85,69.85 270 top
TP21  EXTRA_3  [KEYSTONE_5000_MINIATURE]  54.93,69.85 270 top
TP22  GND  [KEYSTONE_5000_MINIATURE]  60.01,69.85 90 top
TP23  TPTP15R  [TP15R]  98.11,69.85 0 top
U1  MCP4725  [SOT23-6]  24.29,16.51 90 top
U2  SN65EPT22DGK  [SOP65P490X110-8N]  40.01,17.3 0 top
U3  SN65EPT21DGK  [SOP65P490X110-8N]  39.85,32.07 90 top
X1  CONN_PULLDN_SENSE  [J502-ND-142-0701-881/886]  2.22,15.88 0 top
X2  CONN_FORCE_QUENCH  [J502-ND-142-0701-881/886]  117.79,15.88 180 top
X3  KEYSTONE-7774  [KEYSTONE-7774]  120.02,26.67 180 top
X4  CONN_SPAD  [J502-ND-142-0701-881/886]  2.22,37.47 0 top
X5  CONN_PHOTON_COUNTER  [J502-ND-142-0701-881/886]  117.79,37.47 180 top
X6  KEYSTONE-7774  [KEYSTONE-7774]  0,48.26 0 top
X7  CONN_SMU  [J502-ND-142-0701-881/886]  2.22,59.05 0 top
X8  61729-0010BLF  [PN61729-S]  111.44,59.69 90 top
XTAL1  CSTCE8M00G15L99-R0  [CSTCE_G15L/CSTCE_GH5L]  73.82,47.62 0 top